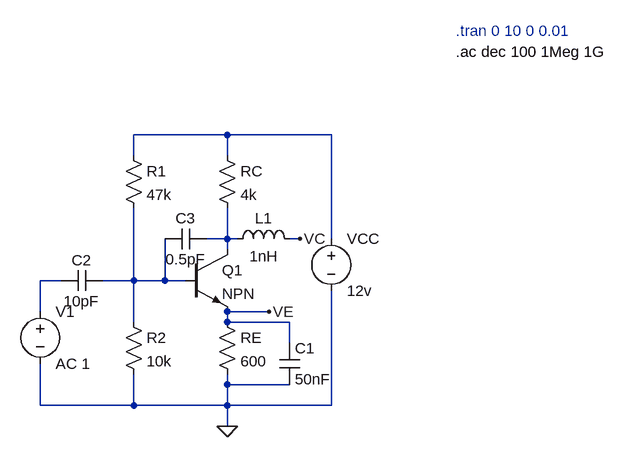
[diagram p0: schematic Draft1.asc]
Draft1.asc, the LTspice schematic file:
Version 4.1
SHEET 1 880 680
WIRE 192 -112 48 -112
WIRE 352 -112 192 -112
WIRE 48 -80 48 -112
WIRE 192 -80 192 -112
WIRE 192 48 192 0
WIRE 192 48 160 48
WIRE 208 48 192 48
WIRE 304 48 288 48
WIRE 352 48 352 -112
WIRE 192 64 192 48
WIRE -64 112 -96 112
WIRE 48 112 48 0
WIRE 48 112 0 112
WIRE 96 112 96 48
WIRE 96 112 48 112
WIRE 128 112 96 112
WIRE -96 160 -96 112
WIRE 256 160 192 160
WIRE 48 176 48 112
WIRE 192 176 192 160
WIRE 288 176 192 176
WIRE 288 208 288 176
WIRE 192 272 192 256
WIRE 288 272 192 272
WIRE -96 304 -96 240
WIRE 48 304 48 256
WIRE 48 304 -96 304
WIRE 192 304 192 272
WIRE 192 304 48 304
WIRE 352 304 352 128
WIRE 352 304 192 304
WIRE 192 336 192 304
FLAG 192 336 0
FLAG 304 48 VC
FLAG 256 160 VE
SYMBOL npn 128 64 R0
SYMATTR InstName Q1
SYMBOL res 176 -96 R0
SYMATTR InstName RC
SYMATTR Value 4k
SYMBOL res 176 160 R0
SYMATTR InstName RE
SYMATTR Value 600
SYMBOL res 32 -96 R0
SYMATTR InstName R1
SYMATTR Value 47k
SYMBOL res 32 160 R0
SYMATTR InstName R2
SYMATTR Value 10k
SYMBOL voltage 352 32 R0
SYMATTR InstName VCC
SYMATTR Value 12v
SYMBOL cap 272 208 R0
SYMATTR InstName C1
SYMATTR Value 50nF
SYMBOL voltage -96 144 R0
SYMATTR InstName V1
SYMATTR Value AC 1
SYMBOL cap 0 96 R90
WINDOW 0 0 32 VBottom 2
WINDOW 3 32 32 VTop 2
SYMATTR InstName C2
SYMATTR Value 10pF
SYMBOL ind 192 64 R270
WINDOW 0 32 56 VTop 2
WINDOW 3 5 56 VBottom 2
SYMATTR InstName L1
SYMATTR Value 1nH
SYMBOL cap 160 32 R90
WINDOW 0 0 32 VBottom 2
WINDOW 3 32 32 VTop 2
SYMATTR InstName C3
SYMATTR Value 0.5pF
TEXT 544 -272 Left 2 ;.tran 0 10 0 0.01
TEXT 544 -240 Left 2 !.ac dec 100 1Meg 1G

The netlist it stands for:
* Draft1.asc
Q1 N002 N004 VE 0 NPN
RC N001 N002 4k
RE VE 0 600
R1 N001 N004 47k
R2 N004 0 10k
VCC N001 0 12v
C1 VE 0 50nF
V1 N003 0 AC 1
C2 N004 N003 10pF
L1 N002 VC 1nH
C3 N002 N004 0.5pF
.model NPN NPN
.model PNP PNP
.lib standard.bjt
* .tran 0 10 0 0.01
.ac dec 100 1Meg 1G
.backanno
.end